# Altium schematic sheet Sheet2.SchDoc
size A4
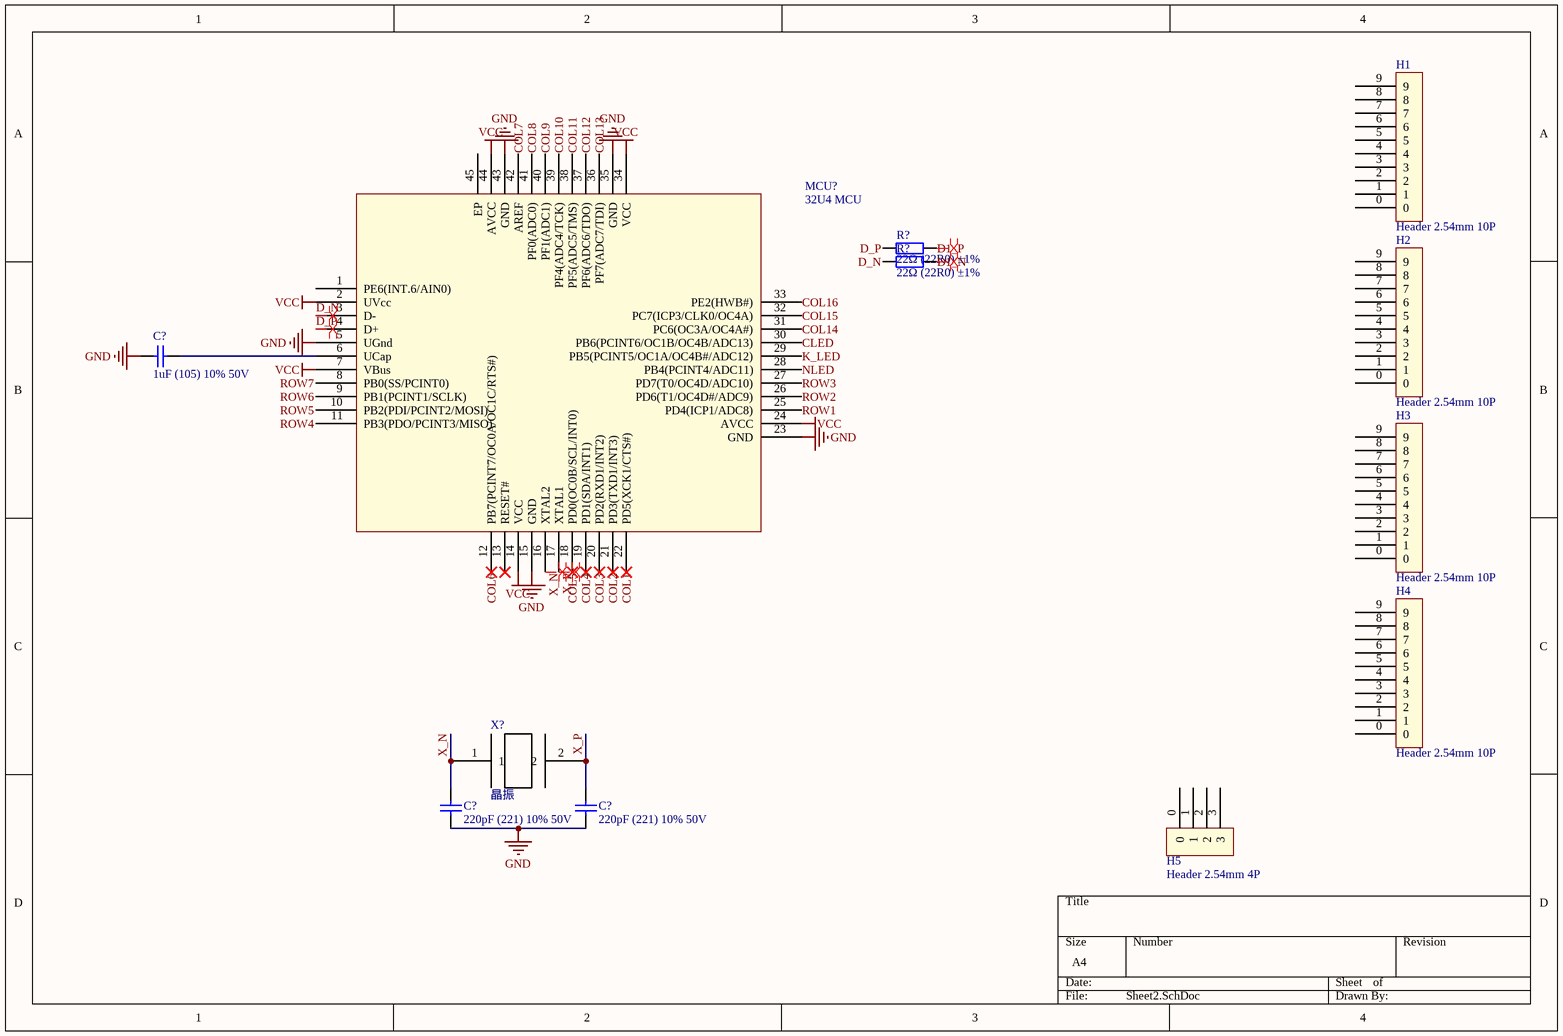
[diagram p0: Sheet2.SchDoc]

## Parts
(Parts that share a designator on the sheet are numbered #1, #2 ... from top to bottom, then left to right.)
C?#1  1uF (105) 10% 50V  [1206_C]
C?#2  220pF (221) 10% 50V  [1206_C]
C?#3  220pF (221) 10% 50V  [1206_C]
H1  Header 2.54mm 10P  [Header 2.54mm 10P]
H2  Header 2.54mm 10P  [Header 2.54mm 10P]
H3  Header 2.54mm 10P  [Header 2.54mm 10P]
H4  Header 2.54mm 10P  [Header 2.54mm 10P]
H5  Header 2.54mm 4P  [Header 2.54mm 4P]
MCU?  32U4 MCU  [32U4]
R?#1  22Ω (22R0) ±1%  [1206_R]
R?#2  22Ω (22R0) ±1%  [1206_R]
X?  晶振  [OSC-SMD_2P-L5.0-W3.2]

## Nets
GND: C?#1.1 C?#2.1 C?#3.1 MCU?.5(UGnd) MCU?.15(GND) MCU?.23(GND) MCU?.35(GND) MCU?.43(GND)
VCC: MCU?.2(UVcc) MCU?.7(VBus) MCU?.14(VCC) MCU?.24(AVCC) MCU?.34(VCC) MCU?.44(AVCC)
CLED: MCU?.30(PB6(PCINT6/OC1B/OC4B/ADC13))
COL1: MCU?.22(PD5(XCK1/CTS#))
COL2: MCU?.21(PD3(TXD1/INT3))
COL3: MCU?.20(PD2(RXD1/INT2))
COL4: MCU?.19(PD1(SDA/INT1))
COL5: MCU?.18(PD0(OC0B/SCL/INT0))
COL6: MCU?.12(PB7(PCINT7/OC0A/OC1C/RTS#))
COL7: MCU?.42(AREF)
COL8: MCU?.41(PF0(ADC0))
COL9: MCU?.40(PF1(ADC1))
COL10: MCU?.39(PF4(ADC4/TCK))
COL11: MCU?.38(PF5(ADC5/TMS))
COL12: MCU?.37(PF6(ADC6/TDO))
COL13: MCU?.36(PF7(ADC7/TDI))
COL14: MCU?.31(PC6(OC3A/OC4A#))
COL15: MCU?.32(PC7(ICP3/CLK0/OC4A))
COL16: MCU?.33(PE2(HWB#))
D1_N: R?#2.2
D1_P: R?#1.2
D_N: MCU?.3(D-) R?#2.1
D_P: MCU?.4(D+) R?#1.1
K_LED: MCU?.29(PB5(PCINT5/OC1A/OC4B#/ADC12))
NLED: MCU?.28(PB4(PCINT4/ADC11))
ROW1: MCU?.25(PD4(ICP1/ADC8))
ROW2: MCU?.26(PD6(T1/OC4D#/ADC9))
ROW3: MCU?.27(PD7(T0/OC4D/ADC10))
ROW4: MCU?.11(PB3(PDO/PCINT3/MISO))
ROW5: MCU?.10(PB2(PDI/PCINT2/MOSI))
ROW6: MCU?.9(PB1(PCINT1/SCLK))
ROW7: MCU?.8(PB0(SS/PCINT0))
X_N: C?#2.2 MCU?.16(XTAL2) X?.1
X_P: C?#3.2 MCU?.17(XTAL1) X?.2
NetC?#1_2: C?#1.2 MCU?.6(UCap)

Not connected (* = marked no-connect by the designer): H1 0 1 2 3 4 5 6 7 8 9; H2 0 1 2 3 4 5 6 7 8 9; H3 0 1 2 3 4 5 6 7 8 9; H4 0 1 2 3 4 5 6 7 8 9; H5 0 1 2 3; MCU? 1(PE6(INT.6/AIN0)) 13(RESET#)* 45(EP)

## Layout directives
differential pair: D1_N, D1_P, D_N, D_P, X_N, X_P

## Library data of the parts
C?#1 = 1206 1uF (105) 10% 50V: 贴片电容; ComponentLink1Description: 供应商链接; ComponentLink1URL: http://www.szlcsc.com/product/details_2200.html; Package: 1206; Supplier: LC; SuppliersPartNumber: C1848
C?#2 C?#3 = 1206 220pF (221) 10% 50V: 贴片电容; ComponentLink1Description: 供应商链接; ComponentLink1URL: http://www.szlcsc.com/product/details_2206.html; Package: 1206; Supplier: LC; SuppliersPartNumber: C1854
R?#1 R?#2 = 1206 22Ω (22R0) 1%: 贴片电阻; ComponentLink1Description: 供应商链接; ComponentLink1URL: http://www.szlcsc.com/product/details_18646.html; Package: 1206; Supplier: LC; SuppliersPartNumber: C17958